# EasyEDA schematic ECE411.json
TITLE: Arduino Micro Clone; REV: 1.1; Date: 2019-11-08; Sheet: 1/1; Drawn By: mchalona; Company: ECE411
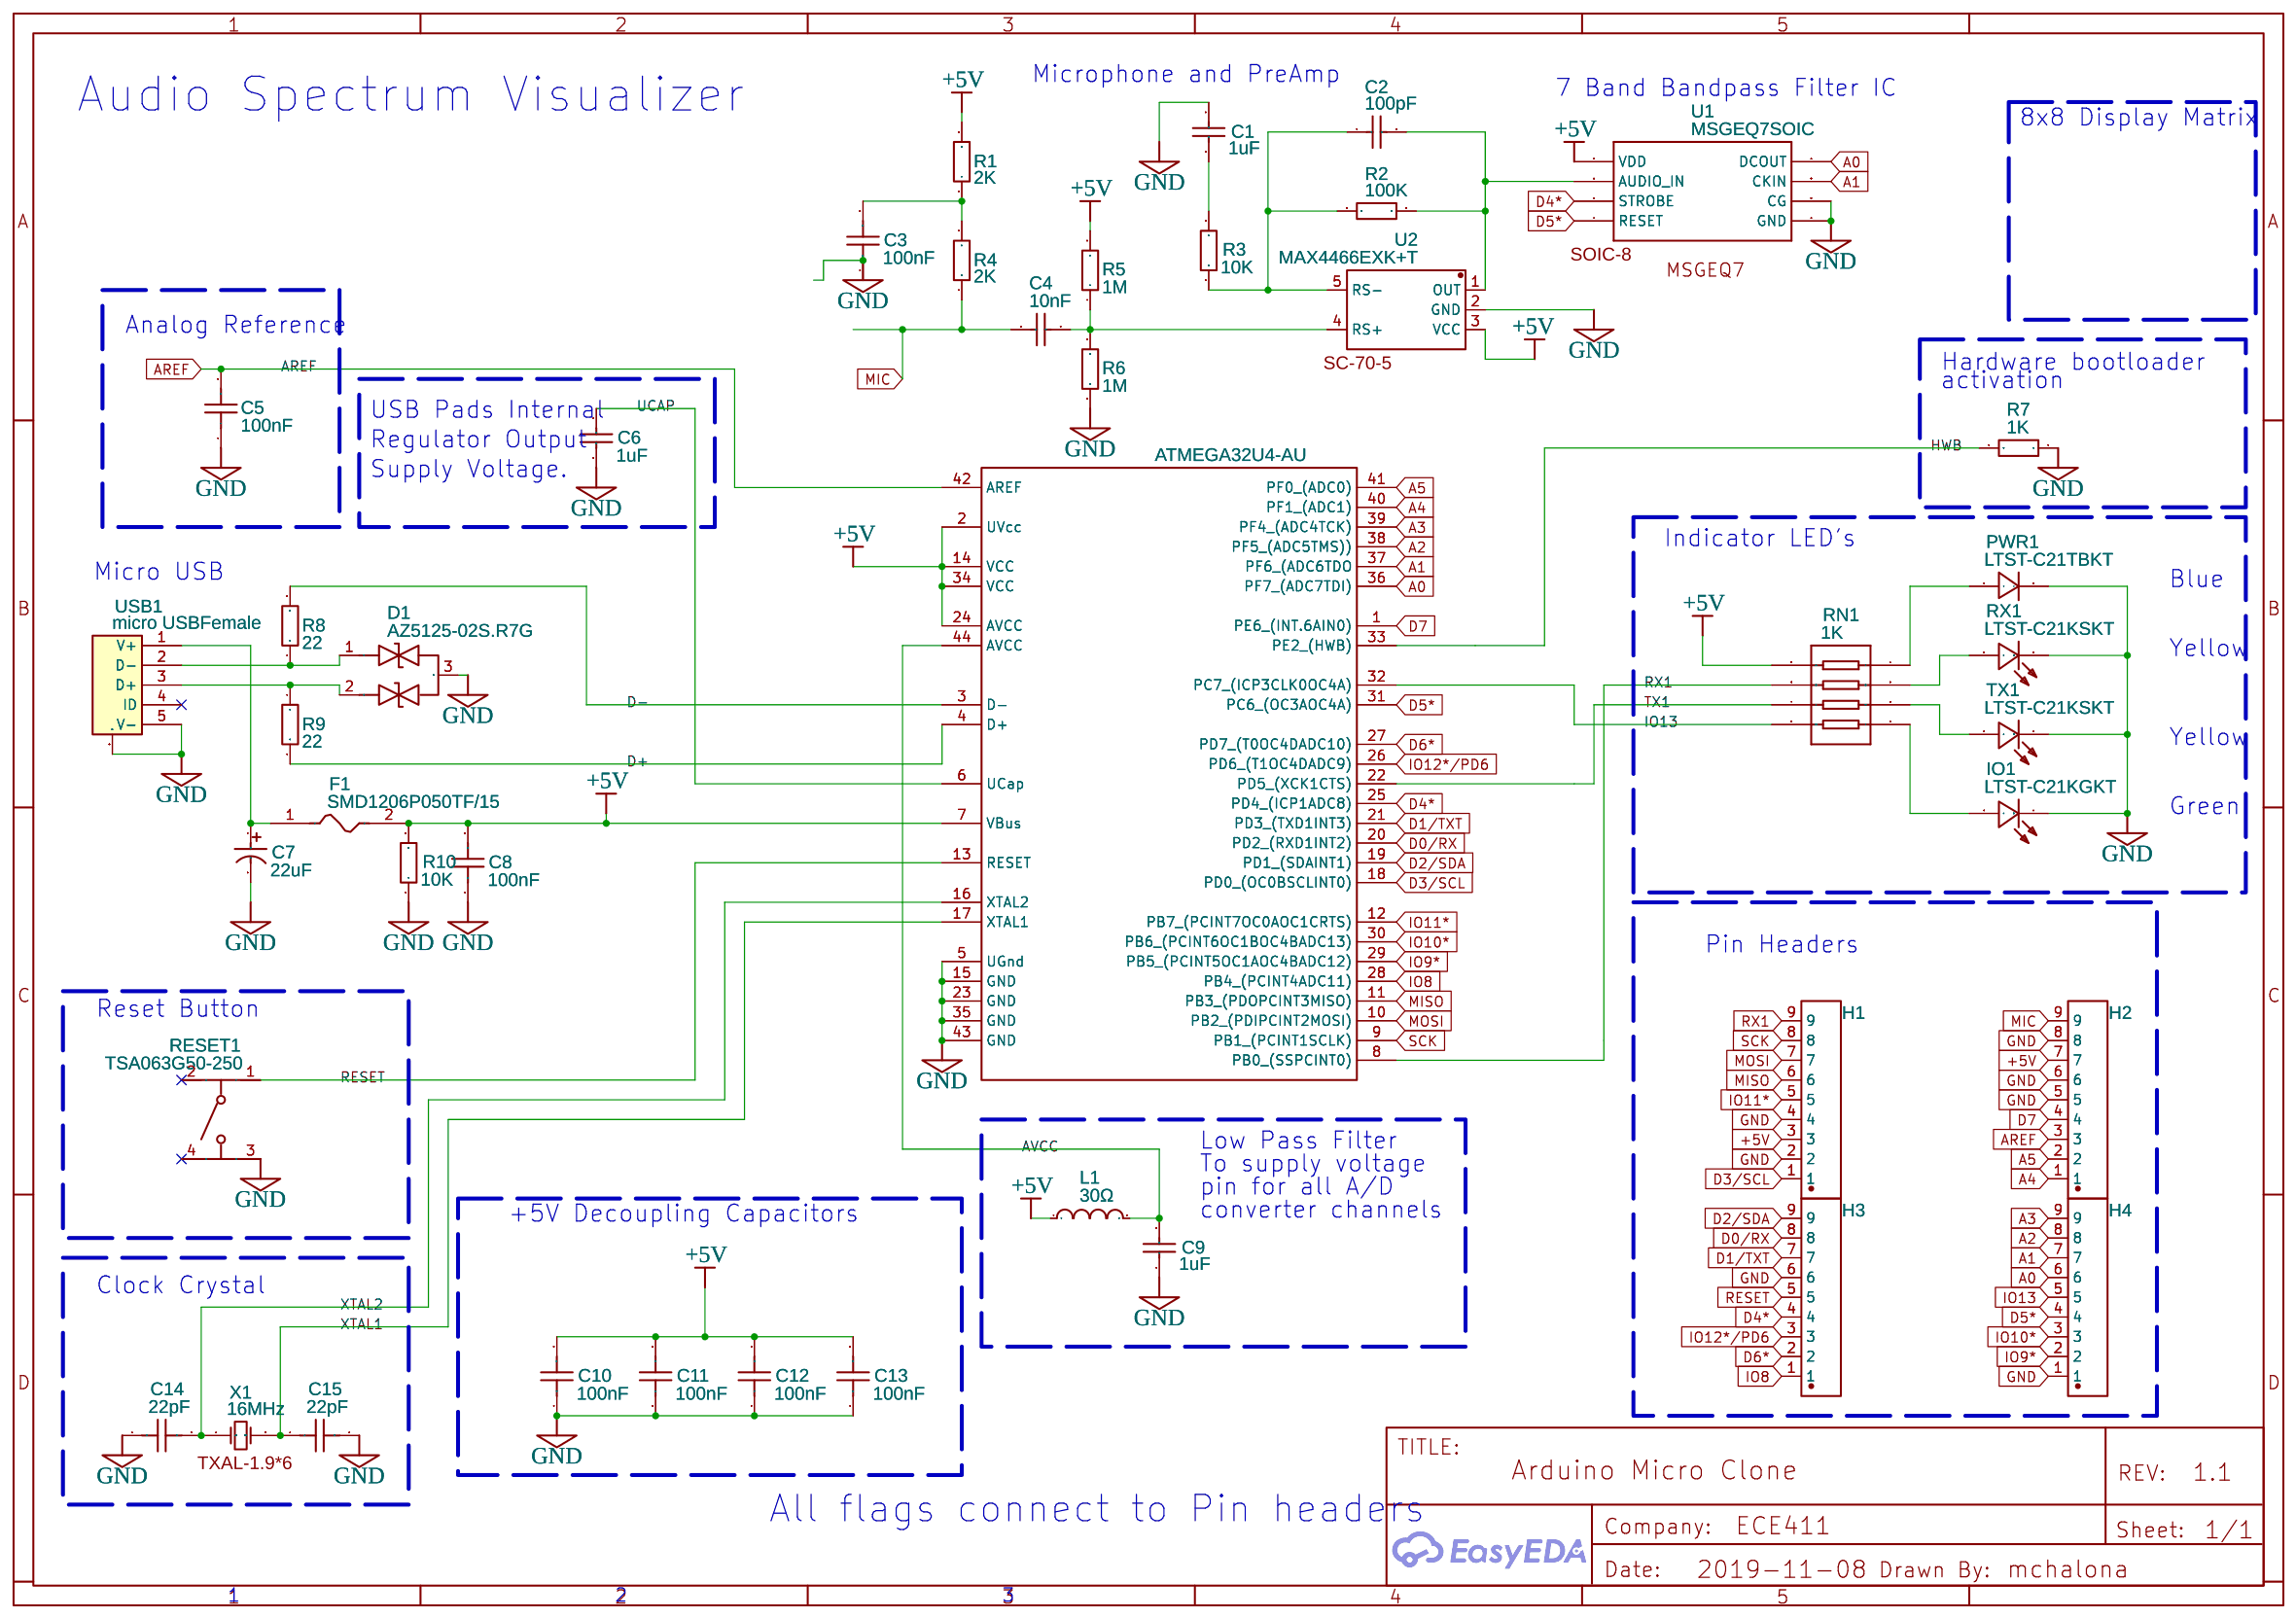
[diagram p0: schematic sheet]

## Parts
ATMEGA1U4-AU  ATMEGA32U4-AU  [QFP-44_10X10X08P]
C1  1uF  [0603]
C2  100pF  [0603]
C3  100nF  [0603]
C4  10nF  [0603]
C5  100nF  [0603]
C6  1uF  [0603]
C7  22uF  [CAP-SMD_BD5.0-L5.3-W5.3-FD]
C8  100nF  [0603]
C9  1uF  [0603]
C10  100nF  [0603]
C11  100nF  [0603]
C12  100nF  [0603]
C13  100nF  [0603]
C14  22pF  [0805]
C15  22pF  [0805]
D1  AZ5125-02S.R7G  [SOT-23-3_L2.9-W1.6-P1.90-LS2.8-BR]
F1  SMD1206P050TF/15  [FUSE-1206]
H1  A2541WV-9P  [SIP-2.54MM-9P-CJT-H8.54]
H2  A2541WV-9P  [SIP-2.54MM-9P-CJT-H8.54]
H3  A2541WV-9P  [SIP-2.54MM-9P-CJT-H8.54]
H4  A2541WV-9P  [SIP-2.54MM-9P-CJT-H8.54]
IO1  LTST-C21KGKT  [LED-SMD-3.2X1.6X1.1]
L1  30Ω  [0805]
PWR1  LTST-C21TBKT  [LED-SMD-3.2X1.6X1.1]
R1  2K  [0603]
R2  100K  [0603]
R3  10K  [0805]
R4  2K  [0603]
R5  1M  [0603]
R6  1M  [0603]
R7  1K  [0805]
R8  22  [0805]
R9  22  [0805]
R10  10K  [0805]
RESET1  TSA063G50-250  [SW-SMD-T6X6-9.5X5.8]
RN1  1K  [1206_X4]
RX1  LTST-C21KSKT  [LED-SMD-3.2X1.6X1.1]
TX1  LTST-C21KSKT  [LED-SMD-3.2X1.6X1.1]
U1  MSGEQ7SOIC  [SOIC-8]
U2  MAX4466EXK+T  [SC-70-5]
USB1  micro USBFemale  [MICRO-USB-1]
X1  16MHz  [TXAL-1.9*6]

## Library data of the parts
ATMEGA1U4-AU = -: Supplier: LCSC; Manufacturer: MICROCHIP; image: //image.lceda.cn/szlcsc/C44854.jpg; Supplier Part: C44854; LCSC Assembly: Yes; SMT Type: Extend
C1 C6 C9 = CL10A105KP8NNNC: Supplier: LCSC; Manufacturer: SAMSUNG; Supplier Part: C26413
C2 = 0603CG101J500NT: Supplier: LCSC; Manufacturer: FH; Supplier Part: C1635; LCSC Assembly: Yes; SMT Type: Extend
C3 C5 C8 C10-C13 = 0603B104J500NT: Supplier: LCSC; Manufacturer: FH; Supplier Part: C88136
C4 = 0603B103J500NT: Supplier: LCSC; Manufacturer: FH; Contributor: LCSC; Supplier Part: C124567
C7 = RVT1V220M0505-C23289: Supplier: LCSC; Manufacturer: HONOR; Manufacturer Part: RVT1V220M0505; Supplier Part: C23289
C14 C15 = 0805CG220J500NT: Supplier: LCSC; Manufacturer: FH; Supplier Part: C24658
D1 = -: Supplier: LCSC; Supplier Part: C356820; Manufacturer: AMAZING; Contributor: LCSC
F1 = -: Supplier: LCSC; Manufacturer: PTTC; Supplier Part: C106264
H1-H4 = -: Supplier: LCSC; Supplier Part: C225484; Manufacturer: Changjiang Connectors; Contributor: LCSC
IO1 = -: Supplier: LCSC; Supplier Part: C284938; Manufacturer: Lite-On; Contributor: LCSC
L1 = MLB2012-300P3A(f): Supplier: LCSC; Manufacturer: ReliaPro; Supplier Part: C50503
PWR1 = -: Supplier: LCSC; Supplier Part: C284941; Manufacturer: Lite-On; Contributor: LCSC
R1 R4 = RC0603FR-072KL: Supplier: LCSC; Manufacturer: YAGEO; Supplier Part: C105576
R2 = RC0603FR-07100KL: Supplier: LCSC; Supplier Part: C14675; Manufacturer: YAGEO; Contributor: LCSC
R3 R10 = RC0805FR-0710KL: Supplier: LCSC; Manufacturer: YAGEO; Supplier Part: C84376
R5 R6 = RC0603FR-071ML: Supplier: LCSC; Manufacturer: YAGEO; Supplier Part: C105578
R7 = 0805W8F1001T5E: Supplier: LCSC; Manufacturer: UniOhm; LCSC Assembly: Yes; Supplier Part: C17513; SMT Type: Basic
R8 R9 = 0805W8J0220T5E: Supplier: LCSC; Manufacturer: UniOhm; Supplier Part: C25295
RESET1 = -: Supplier: LCSC; Supplier Part: C294565; Manufacturer: BRIGHT; Contributor: LCSC
RN1 = CRA064RJ1KE04: Supplier: LCSC; Manufacturer: EVER OHMS; Contributor: LCSC; Supplier Part: C149873
RX1 TX1 = -: Supplier: LCSC; Supplier Part: C284940; Manufacturer: Lite-On; Contributor: LCSC
U1 = -: 7-band graphic equalizer; Contributor: SparkFun; Package Display: Yes
U2 = -: Supplier: LCSC; Supplier Part: C143459; Manufacturer: Maxim Integrated; Manufacturer Part: MAX4073TAXK+T; Contributor: LCSC; LCSC Assembly: Yes; SMT Type: Extend; Package Display: Yes
USB1 = -: Supplier: LCSC; Manufacturer: ValuePro; image: //image.lceda.cn/szlcsc/C10418.jpg; Supplier Part: C10418
X1 = X206016MSD2SC: Supplier: LCSC; Manufacturer: YXC; Supplier Part: C2174; Package Display: Yes

## Nets
+5V: ATMEGA1U4-AU.2(UVcc) ATMEGA1U4-AU.7(VBus) ATMEGA1U4-AU.14(VCC) ATMEGA1U4-AU.24(AVCC) ATMEGA1U4-AU.34(VCC) C8.2 C10.2 C11.2 C12.2 C13.2 F1.2 H1.3 H2.7 L1.1 R1.2 R5.2 R10.2 RN1.5 U1.1(VDD) U2.3(VCC)
AVCC: ATMEGA1U4-AU.44(AVCC) C9.2 L1.2
GND: ATMEGA1U4-AU.5(UGnd) ATMEGA1U4-AU.15(GND) ATMEGA1U4-AU.23(GND) ATMEGA1U4-AU.35(GND) ATMEGA1U4-AU.43(GND) C1.2 C3.1 C5.1 C6.1 C7.2 C8.1 C9.1 C10.1 C11.1 C12.1 C13.1 C14.1 C15.2 D1.3 H1.2 H1.4 H2.5 H2.6 H2.8 H3.6 H4.1 IO1.1(C) PWR1.2(-) R6.1 R7.1 R10.1 RESET1.3 RX1.1(C) TX1.1(C) U1.2(GND) U1.6(CG) U2.2(GND) USB1.0(MTN) USB1.5(V-)
A0: ATMEGA1U4-AU.36(PF7 (ADC7TDI)) H4.6 U1.3(DCOUT)
A1: ATMEGA1U4-AU.37(PF6 (ADC6TDO) H4.7 U1.8(CKIN)
A2: ATMEGA1U4-AU.38(PF5 (ADC5TMS))) H4.8
A3: ATMEGA1U4-AU.39(PF4 (ADC4TCK)) H4.9
A4: ATMEGA1U4-AU.40(PF1 (ADC1)) H2.1
A5: ATMEGA1U4-AU.41(PF0 (ADC0)) H2.2
AREF: ATMEGA1U4-AU.42(AREF) C5.2 H2.3
D0/RX: ATMEGA1U4-AU.20(PD2 (RXD1INT2)) H3.8
D1/TXT: ATMEGA1U4-AU.21(PD3 (TXD1INT3)) H3.7
D2/SDA: ATMEGA1U4-AU.19(PD1 (SDAINT1)) H3.9
D3/SCL: ATMEGA1U4-AU.18(PD0 (OC0BSCLINT0)) H1.1
D4*: ATMEGA1U4-AU.25(PD4 (ICP1ADC8)) H3.4 U1.4(STROBE)
D5*: ATMEGA1U4-AU.31(PC6 (OC3AOC4A)) H4.4 U1.7(RESET)
D6*: ATMEGA1U4-AU.27(PD7 (T0OC4DADC10)) H3.2
D7: ATMEGA1U4-AU.1(PE6 (INT.6AIN0)) H2.4
D+: ATMEGA1U4-AU.4(D+) R9.2
D-: ATMEGA1U4-AU.3(D-) R8.2
HWB: ATMEGA1U4-AU.33(PE2 (HWB)) R7.2
IO8: ATMEGA1U4-AU.28(PB4 (PCINT4ADC11)) H3.1
IO9*: ATMEGA1U4-AU.29(PB5 (PCINT5OC1AOC4BADC12)) H4.2
IO10*: ATMEGA1U4-AU.30(PB6 (PCINT6OC1BOC4BADC13)) H4.3
IO11*: ATMEGA1U4-AU.12(PB7 (PCINT7OC0AOC1CRTS)) H1.5
IO12*/PD6: ATMEGA1U4-AU.26(PD6 (T1OC4DADC9)) H3.3
IO13: ATMEGA1U4-AU.32(PC7 (ICP3CLK0OC4A)) H4.5 RN1.8
MIC: C4.1 H2.9 R4.1
MISO: ATMEGA1U4-AU.11(PB3 (PDOPCINT3MISO)) H1.6
MOSI: ATMEGA1U4-AU.10(PB2 (PDIPCINT2MOSI)) H1.7
RESET: ATMEGA1U4-AU.13(RESET) H3.5 RESET1.1
RX1: ATMEGA1U4-AU.8(PB0 (SSPCINT0)) H1.9 RN1.6
SCK: ATMEGA1U4-AU.9(PB1 (PCINT1SCLK)) H1.8
TX1: ATMEGA1U4-AU.22(PD5 (XCK1CTS)) RN1.7
UCAP: ATMEGA1U4-AU.6(UCap) C6.2
XTAL1: ATMEGA1U4-AU.17(XTAL1) C15.1 X1.2(OSC2)
XTAL2: ATMEGA1U4-AU.16(XTAL2) C14.2 X1.1(OSC1)
Net-(C1-1): C1.1 R3.2
Net-(C2-1): C2.1 R2.2 R3.1 U2.5(RS-)
Net-(C2-2): C2.2 R2.1 U1.5(AUDIO_IN) U2.1(OUT)
Net-(C3-2): C3.2 R1.1 R4.2
Net-(C4-2): C4.2 R5.1 R6.2 U2.4(RS+)
Net-(C7-1): C7.1 F1.1 USB1.1(V+)
Net-(D1-1): D1.1 R8.1 USB1.2(D-)
Net-(D1-2): D1.2 R9.1 USB1.3(D+)
Net-(IO1-2): IO1.2(A) RN1.1
Net-(PWR1-1): PWR1.1(+) RN1.4
Net-(RN1-2): RN1.2 TX1.2(A)
Net-(RN1-3): RN1.3 RX1.2(A)

Not connected (* = marked no-connect by the designer): RESET1 2* 4*; USB1 4(ID)*

## Notes on the sheet
- Microphone and PreAmp
- Audio Spectrum Visualizer
- 7 Band Bandpass Filter IC
- 8x8 Display Matrix
- Analog Reference
- activation
- Hardware bootloader
- USB Pads Internal
- Regulator Output
- Supply Voltage.
- Indicator LED's
- Micro USB
- Blue
- Yellow
- Yellow
- Green
- Pin Headers
- Reset Button
- Low Pass Filter
- To supply voltage
- pin for all A/D
- +5V Decoupling Capacitors
- converter channels
- Clock Crystal
- All flags connect to Pin headers
- 1
- 2
- 3
